# EAGLE design pcb bobinadora (EAGLE 6.4)
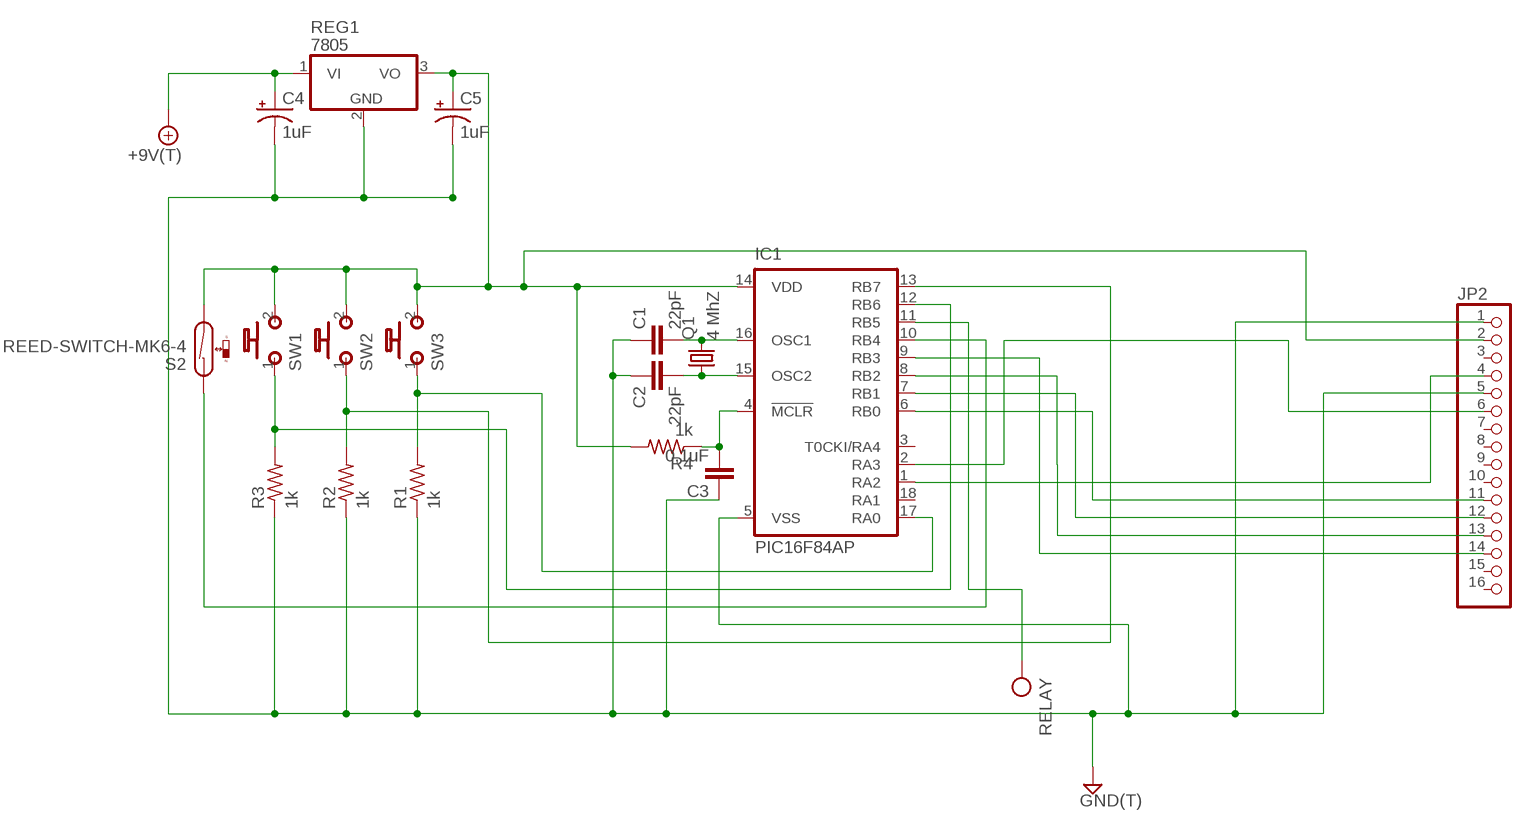
[diagram p0: schematic, sheet 1]

## Parts
+9V1  +9V(T)  [SQUARE]
C1  22pF  050X030_0251  [050X030_025]
C2  22pF  050X030_0251  [050X030_025]
C3  0,1uF  050X030_0251  [050X030_025]
C4  1uF  050  [050_020]
C5  1uF  050  [050_020]
GND2  GND(T)  [SQUARE]
IC1  PIC16F84AP  [DIL18]
JP2  PINHD-1X16  [1X16]
Q1  4 MhZ  CRYSTALHC18U-V  [HC18U-V]
R1  1k  6MM.4  [R0207/4]
R2  1k  6MM.4  [R0207/4]
R3  1k  6MM.4  [R0207/4]
R4  1k  6MM.4  [R0207/4]
REG1  7805  [TO92-]
RELAY  OUT(T)  [SQUARE]
S2  REED-SWITCH-MK6-4  [MK6-4]
SW1  MOMENTARY  [SPST]
SW2  MOMENTARY  [SPST]
SW3  MOMENTARY  [SPST]

## Nets
GND: C1.1 C2.1 C3.1 C4.- C5.- GND2.1(GND) IC1.5(VSS) R1.1 R2.1 R3.1 REG1.2(GND)
N$1: IC1.6(RB0) JP2.11
N$2: IC1.7(RB1) JP2.12
N$3: IC1.8(RB2) JP2.13
N$4: IC1.9(RB3) JP2.14
N$5: IC1.1(RA2) JP2.4
N$6: IC1.2(RA3) JP2.6
N$7: IC1.12(RB6) R3.2 SW1.1(P)
N$8: IC1.13(RB7) R2.2 SW2.1(P)
N$9: IC1.17(RA0) R1.2 SW3.1(P)
N$10: C1.2 IC1.16(OSC1) Q1.2
N$11: IC1.10(RB4) S2.1
N$12: C2.2 IC1.15(OSC2) Q1.1
N$14: C3.2 IC1.4(!MCLR) R4.1
N$17: JP2.1 JP2.5
OUT: IC1.11(RB5) RELAY.1(OUT)
PWR: +9V1.1(+9V) C4.+ C5.+ IC1.14(VDD) JP2.2 R4.2 REG1.1(VI) REG1.3(VO) S2.2 SW1.2(S) SW2.2(S) SW3.2(S)
Unconnected: IC1.3(T0CKI/RA4) IC1.18(RA1) JP2.3 JP2.7 JP2.8 JP2.9 JP2.10 JP2.15 JP2.16

## Library data of the parts
+9V1 = gm-supply:+9V(T): +9V Voltage Supply use this to hook up +9v throughout a schematic instead of running wire automatically labels the net "+9v" adds a hookup pad to the circuit board
C1-C3 = gm-caps-ceramic:050X030_025: 47 - 120pF Xicon Ceramic Disc 2.5mm lead spacing
C4 C5 = gm-caps-electro-pol:050: 0.22 - 100uF Xicon values at Mouser.com: 10V: 10 - 100uF; 16V: 2.2 - 47uF; 25V: 0.47 - 47uF; 50V: 0.22 - 22uF
GND2 = gm-supply:GND(T): Ground use this to hook up ground (GND) throughout a schematic instead of running wire automatically labels the net "GND" adds a hookup pad to the circuit board (you can use several)
IC1 = microchip:PIC16F8*: MICROCONTROLLER 8-Bit PIC16F8X Family - CMOS Flash/EEPROM Pin Compatible : PIC16F83, PIC16CR83, PIC16F84A, PIC16CR84 see also PIC16C* <DEVICE:PIC16C*>; MF: MICROCHIP; MPN: PIC16F84A-04I/P; OC_FARNELL: 9760865; OC_NEWARK: 69K7635
JP2 = pinhead:PINHD-1X16: PIN HEADER
Q1 = crystal:CRYSTAL: CRYSTAL; OC_FARNELL: unknown; OC_NEWARK: unknown
R1-R4 = gm-resistors:6MM: 6mm Resistors Leads spaced 1-6 holes apart for 0.1" perfboard. Suitable for 1/4 watt resistors.
REG1 = gm-regulators:7805
RELAY = gm-supply:OUT(T): Output obsolete: use Pad instead and label net output label with circuit board terminal/pad usually appears only once on a schematic
S2 = switch-reed:REED-SWITCH-: Reed Sensor; OC_FARNELL: unknown
SW1-SW3 = gm-switches:MOMENTARY

## Board
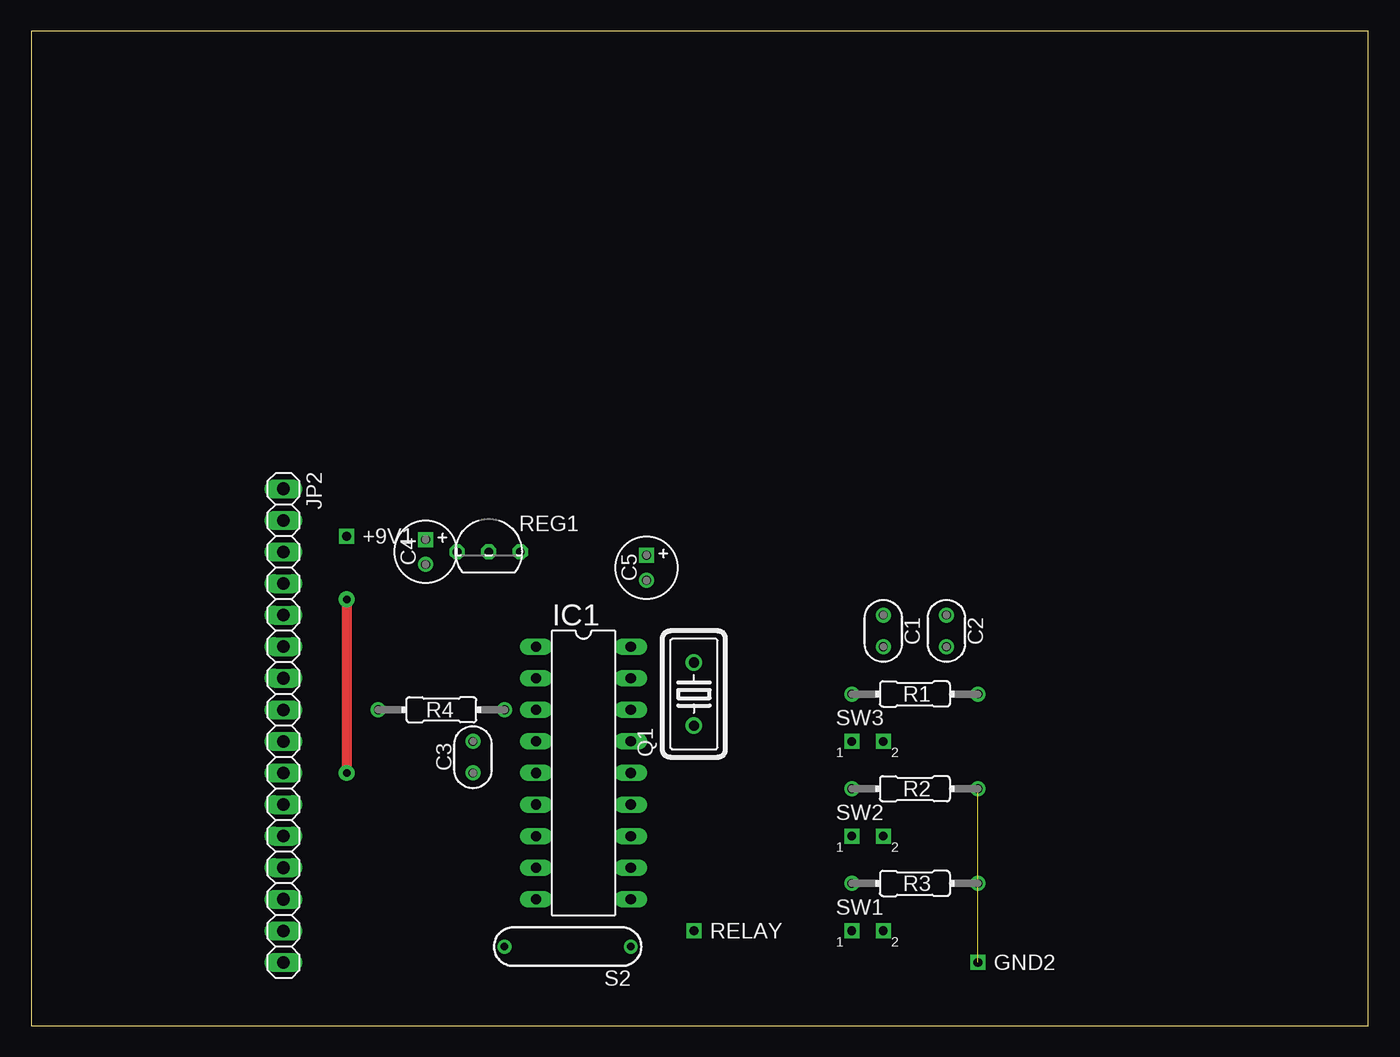
[diagram p1: board, top side]
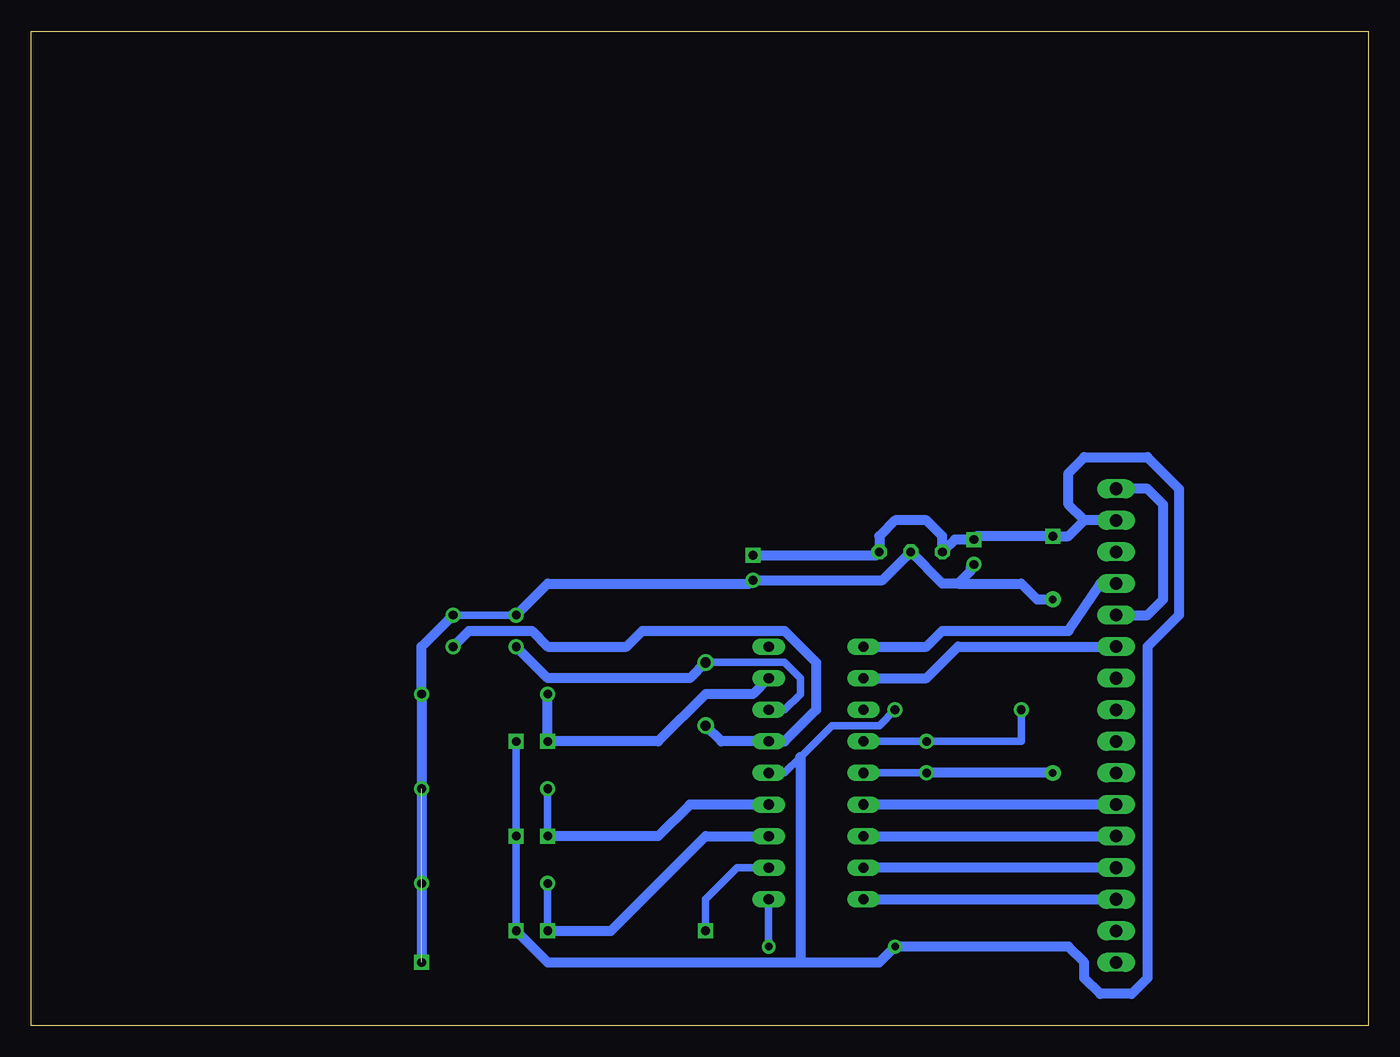
[diagram p2: board, bottom side, seen from below]

Size 107.62 x 80 mm. Coordinates in mm from the lower left corner, seen from the top.
Outline: 0,0 107.62,0 107.62,80 0,80 0,0
Copper layers (1*16): Top 0.035mm / dielectric 1.5mm / Bottom 0.035mm
Design rules "default": minimum track width 10mil, minimum drill 24mil, track to track 8mil, track to pad 8mil, pad to pad 8mil, via to via 8mil, smd to smd 8mil, copper to edge 40mil, drill to drill 8mil, minimum pad ring 10mil, minimum via ring 8mil, stop-mask expansion 4mil, vias tented up to drill 0mil, thermal gap 10mil

### Footprints (pad centres in the part's own frame; a part is rotated, then mirrored left to right if it is on the bottom)
SQUARE = drill 0.7 square: 1 0,0
050X030_025 = drill 0.7: 1 -1.27,0; 2 1.27,0
050_020 = drill 0.7 square: + -1,0 | drill 0.7: - 1,0
DIL18 = drill 0.813 long: 1 -10.16,-3.81; 2 -7.62,-3.81; 3 -5.08,-3.81; 4 -2.54,-3.81; 5 0,-3.81; 6 2.54,-3.81; 7 5.08,-3.81; 8 7.62,-3.81; 9 10.16,-3.81; 10 10.16,3.81; 11 7.62,3.81; 12 5.08,3.81; 13 2.54,3.81; 14 0,3.81; 15 -2.54,3.81; 16 -5.08,3.81; 17 -7.62,3.81; 18 -10.16,3.81
1X16 = drill 1.016 long: 1 -19.05,0; 2 -16.51,0; 3 -13.97,0; 4 -11.43,0; 5 -8.89,0; 6 -6.35,0; 7 -3.81,0; 8 -1.27,0; 9 1.27,0; 10 3.81,0; 11 6.35,0; 12 8.89,0; 13 11.43,0; 14 13.97,0; 15 16.51,0; 16 19.05,0
HC18U-V = drill 0.813: 1 -2.54,0; 2 2.54,0
R0207/4 = drill 0.7: 1 -5.08,0; 2 5.08,0
TO92- = drill 0.7 octagon: 1 -2.54,0; 2 0,0; 3 2.54,0
MK6-4 = drill 0.6 pad 1.016: 1 -5.08,0; 2 5.08,0
SPST = drill 0.7 square: 1 -1.27,0; 2 1.27,0

### Placement (x,y rotation side)
+9V1  25.4,39.37 0 top
C1  68.58,31.75 270 top
C2  73.66,31.75 270 top
C3  35.56,21.59 90 top
C4  31.75,38.1 270 top
C5  49.53,36.83 270 top
GND2  76.2,5.08 0 top
IC1  44.45,20.32 270 top
JP2  20.32,24.13 270 top
Q1  53.34,26.67 90 top
R1  71.12,26.67 180 top
R2  71.12,19.05 180 top
R3  71.12,11.43 180 top
R4  33.02,25.4 0 top
REG1  36.83,38.1 0 top
RELAY  53.34,7.62 0 top
S2  43.18,6.35 180 top
SW1  67.31,7.62 0 top
SW2  67.31,15.24 0 top
SW3  67.31,22.86 0 top

### Tracks (layer width: path | path; a pad name or v marks a point on that pad's centre or on a via)
GND  (via drill 0.6 pad 1.27)  (2 unrouted)
  Top 0.813: v25.4,34.29 v25.4,20.32
  Bottom 0.61: C2.1 C1.1 | C3.1 IC1.5
  Bottom 0.813: C2.1 76.2,30.48 R1.1 GND2.1 | C1.1 66.04,35.56 49.8,35.56 C5.- 39.1,35.83 REG1.2 34.29,35.56 33.02,35.56 | C4.- 32.02,36.83 32.02,36.56 33.02,35.56 | 33.02,35.56 27.94,35.56 26.67,34.29 v25.4,34.29 | v25.4,20.32 C3.1
N$1
  Bottom 0.813: JP2.11 IC1.6
N$2
  Bottom 0.813: IC1.7 JP2.12
N$3
  Bottom 0.813: JP2.13 IC1.8
N$4
  Bottom 0.813: IC1.9 JP2.14
N$5
  Bottom 0.813: IC1.1 35.56,30.48 34.29,31.75 24.13,31.75 21.59,35.56 JP2.4
N$6
  Bottom 0.813: IC1.2 35.56,27.94 33.02,30.48 JP2.6
N$7
  Bottom 0.61: SW1.1 R3.2
  Bottom 0.813: SW1.1 60.96,7.62 53.34,15.24 IC1.12
N$8
  Bottom 0.61: SW2.1 R2.2
  Bottom 0.813: IC1.13 54.61,17.78 57.15,15.24 SW2.1
N$9
  Bottom 0.61: 62.23,22.86 SW3.1
  Bottom 0.813: IC1.17 49.53,26.67 53.34,26.67 57.15,22.86 SW3.1 R1.2
N$10
  Bottom 0.61: Q1.2 46.99,29.21 45.72,27.94 45.72,26.67 46.99,25.4 IC1.16
  Bottom 0.813: Q1.2 54.61,27.94 66.04,27.94 C1.2
N$11
  Bottom 0.61: IC1.10 S2.1
N$12
  Bottom 0.61: 46.99,31.75 54.61,31.75
  Bottom 0.813: C2.2 72.39,31.75 67.31,31.75 66.04,30.48 59.69,30.48 58.42,31.75 46.99,31.75 44.45,29.21 44.45,25.4 46.99,22.86 IC1.15 52.07,22.86 Q1.1
N$14
  Bottom 0.61: R4.1 27.94,22.86 C3.2 IC1.4
N$17
  Bottom 0.813: JP2.5 17.78,33.02 16.51,34.29 16.51,41.91 17.78,43.18 JP2.1
OUT
  Bottom 0.61: IC1.11 50.8,12.7 53.34,10.16 RELAY.1
PWR
  Bottom 0.61: IC1.14 46.99,20.32 45.72,21.59 43.18,24.13 39.37,24.13 R4.2 | SW1.2 SW2.2 SW3.2
  Bottom 0.813: SW1.2 66.04,5.08 45.72,5.08 | 45.72,5.08 39.37,5.08 S2.2 24.13,6.35 22.86,5.08 22.86,3.81 21.59,2.54 19.05,2.54 17.78,3.81 17.78,30.48 15.24,33.02 15.24,43.18 17.78,45.72 22.86,45.72 24.13,44.45 24.13,41.91 22.86,40.64 | 45.72,21.59 45.72,5.08 | JP2.2 22.86,40.64 | C5.+ 39.64,37.83 REG1.3 39.37,39.37 38.1,40.64 35.56,40.64 34.29,39.37 REG1.1 33.29,39.1 C4.+ 31.48,39.37 +9V1.1 24.13,39.37 22.86,40.64